# EAGLE design Deconspectrum (EAGLE 5.06)
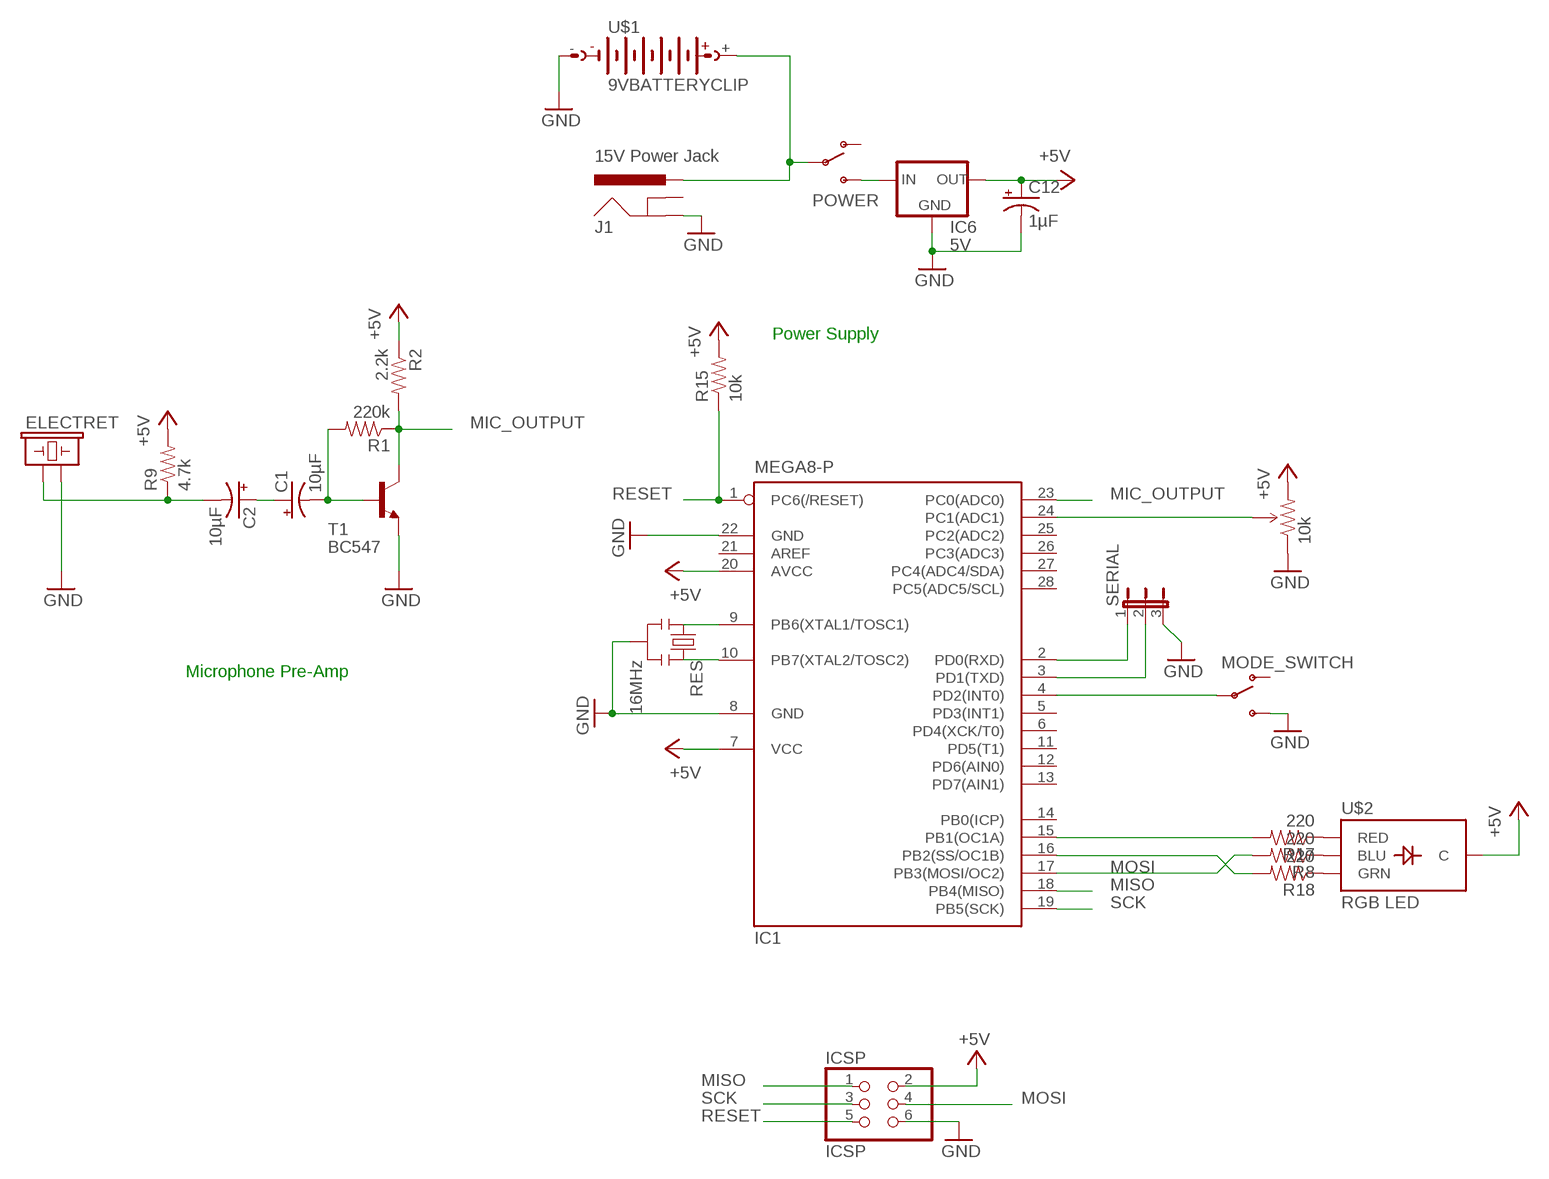
[diagram p0: schematic, sheet 1]

## Parts
C1  10µF  CAP_POLPTH1  [CPOL-RADIAL-100UF-25V]
C2  10µF  CAP_POLPTH1  [CPOL-RADIAL-100UF-25V]
C12  1µF  CAP_POLPTH1  [CPOL-RADIAL-100UF-25V]
ELECTRET  MIC9.7MM  [MIC-9.7MM]
IC1  MEGA8-P  [DIL28-3]
IC6  5V  78XXS  [78XXS]
ICSP  ICSP  PINHD-2X3  [2X03]
J1  15V Power Jack  POWER_JACKPTH  [POWER_JACK_PTH]
MODE_SWITCH  SWITCH-SPSTPTH  [SWITCH-SPDT]
POWER  SWITCH-SPSTPTH  [SWITCH-SPDT]
R1  220k  RESISTORPTH1  [AXIAL-0.3]
R2  2.2k  RESISTORPTH1  [AXIAL-0.3]
R8  220  RESISTORPTH1  [AXIAL-0.3]
R9  4.7k  RESISTORPTH1  [AXIAL-0.3]
R15  10k  RESISTORPTH1  [AXIAL-0.3]
R17  220  RESISTORPTH1  [AXIAL-0.3]
R18  220  RESISTORPTH1  [AXIAL-0.3]
RES  16MHz  RESONATORPTH  [RESONATOR-PTH]
SERIAL  JUMPER-3PTH  [1X03]
T1  BC547  [TO92]
U$1  9VBATTERYCLIP  [9VBATTERYCLIP]
U$2  RGB LED  LED-TRICOLOR-THROUGHHOLE  [LED-TRICOLOR-THROUGHHOLE]
U$3  10k  TRIMPOTPTH  [TRIM_POT_PTH]

## Nets
+5V: C12.1(+) IC1.7(VCC) IC1.20(AVCC) IC6.OUT ICSP.2 R2.P$1 R9.P$2 R15.P$2 U$2.GND(C) U$3.3(CW)
GND: C12.2(-) ELECTRET.2 IC1.8(GND) IC1.22(GND) IC6.GND ICSP.6 J1.GND MODE_SWITCH.3(S) RES.2 SERIAL.3 T1.1(E) U$1.- U$3.1(CCW)
JP1_RX: IC1.3(PD1(TXD)) SERIAL.2
JP1_TX: IC1.2(PD0(RXD)) SERIAL.1
LED_GRN: IC1.16(PB2(SS/OC1B)) R18.P$2
LED_RED: IC1.15(PB1(OC1A)) R17.P$2
MIC_OUTPUT: IC1.23(PC0(ADC0)) R1.P$1 R2.P$2 T1.3(C)
MISO: IC1.18(PB4(MISO)) ICSP.1
MOSI: IC1.17(PB3(MOSI/OC2)) ICSP.4 R8.P$2
N$1: C1.1(+) C2.1(+)
N$2: C1.2(-) R1.P$2 T1.2(B)
N$3: IC1.4(PD2(INT0)) MODE_SWITCH.2(P)
N$4: IC1.24(PC1(ADC1)) U$3.2(WIPER)
N$5: J1.PWR POWER.2(P) U$1.+
N$6: IC6.IN POWER.3(S)
N$7: C2.2(-) ELECTRET.1 R9.P$1
N$12: IC1.9(PB6(XTAL1/TOSC1)) RES.1
N$13: IC1.10(PB7(XTAL2/TOSC2)) RES.3
N$18: R18.P$1 U$2.GRN
N$19: R17.P$1 U$2.RED
N$20: R8.P$1 U$2.BLU
RESET: IC1.1(PC6(/RESET)) ICSP.5 R15.P$1
SCK: IC1.19(PB5(SCK)) ICSP.3
Unconnected: IC1.5(PD3(INT1)) IC1.6(PD4(XCK/T0)) IC1.11(PD5(T1)) IC1.12(PD6(AIN0)) IC1.13(PD7(AIN1)) IC1.14(PB0(ICP)) IC1.21(AREF) IC1.25(PC2(ADC2)) IC1.26(PC3(ADC3)) IC1.27(PC4(ADC4/SDA)) IC1.28(PC5(ADC5/SCL)) J1.GNDBREAK MODE_SWITCH.1(O) POWER.1(O)

## Notes on the sheet
- Power Supply
- Microphone Pre-Amp

## Library data of the parts
C1 C2 C12 = SparkFun:CAP_POL: Capacitor Polarized These are standard SMD and PTH capacitors. Normally 10uF, 47uF, and 100uF in electrolytic and tantalum varieties. Always verify the external diameter of the through hole cap, it varies with capacity, voltage, and manufacturer. The EIA devices should be standard.
ELECTRET = SparkFun:MIC: Microphone Omni-directional electret microphone. 9.7mm standard diameter.
IC1 = atmel:MEGA8-P: MICROCONTROLLER 8 Kbytes FLASH, 1 kbytes SRAM, 512 bytes EEPROM, USART, 4-channel 10 bit ADC, 2-channel 8 bit ADC Pin compatible with Atmega48, ATMega88, ATMega168 Source: avr.lbr
IC6 = v-reg:78XXS: VOLTAGE REGULATOR
ICSP = pinhead:PINHD-2X3: PIN HEADER
J1 = SparkFun:POWER_JACK: Power Jack This is the standard 5.5mm barrel jack for power. The PTH is the most common, proven, reliable, footprint. All others are experimental. The Slot footprint only works if the mill layer is transmitted to the PCB fab house so be warned. Spark Fun Electronics SKU : PRT-00119. Mating wall wart : TOL-00298 (and others)
MODE_SWITCH POWER = SparkFun:SWITCH-SPST: SPST Switch Simple slide switch. Spark Fun Electronics SKU : COM-00102
R1 R2 R8 R9 R15 R17 R18 = SparkFun:RESISTOR: Resistor Basic schematic elements and footprints for 0603, 1206, and PTH 1/10th watt (small) resistors.
RES = SparkFun:RESONATOR: Resonator Small SMD resonator. This is the itty bitty 10/20MHz resonators with built in caps. CSTCE10M0G55 and CSTCE20M0V53. Footprint has been reviewed closely but hasn't been tested yet.
SERIAL = SparkFun:JUMPER-3
T1 = transistor:BC547: NPN TRANSISTOR
U$1 = tedbot:9VBATTERYCLIP: 9V Battery Holder Eagle Plastic Devices 12BH611-GR
U$2 = SparkFun:LED-TRICOLOR-THROUGHHOLE
U$3 = SparkFun:TRIMPOT

## Net classes
0 default: width 0.254 mm, drill 0.305 mm, clearance 0.152 mm
2 gnd: width 0.305 mm, drill 0.508 mm, clearance 0.152 mm
3 usbvcc: width 0.508 mm, drill 0.508 mm, clearance 0.152 mm

## Board
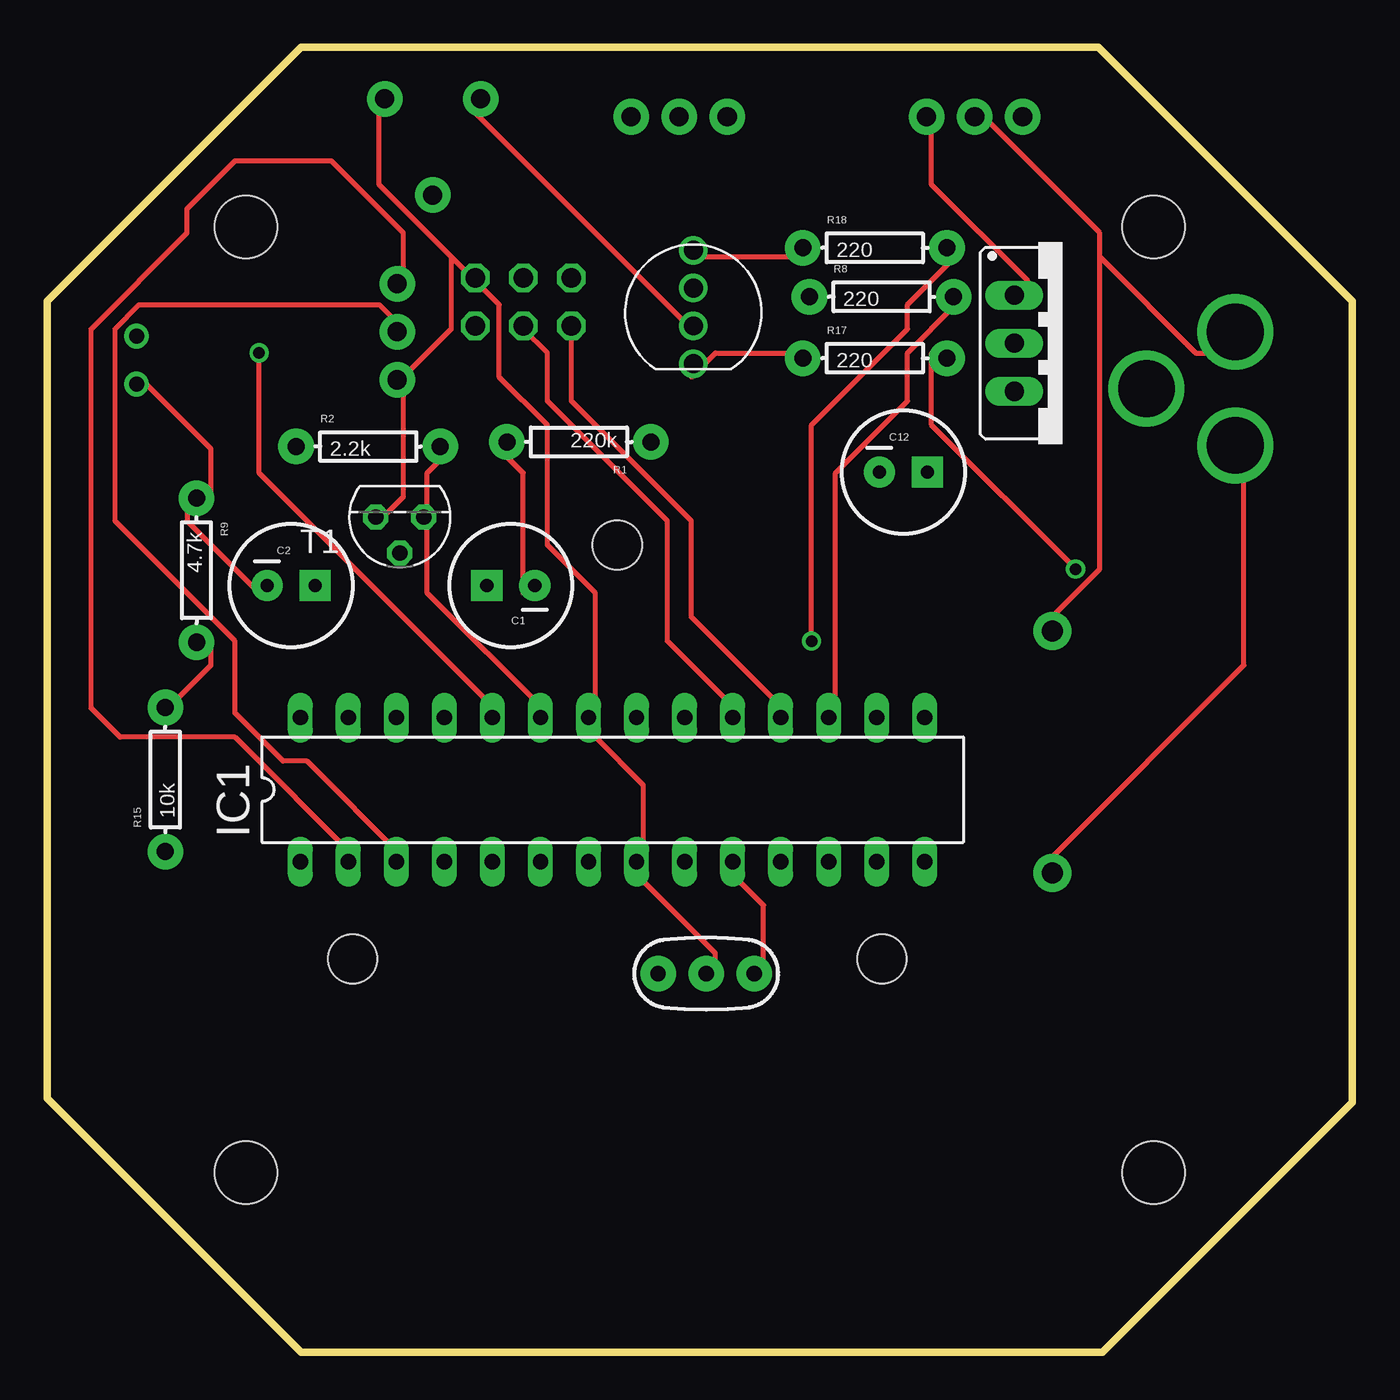
[diagram p1: board, top side]
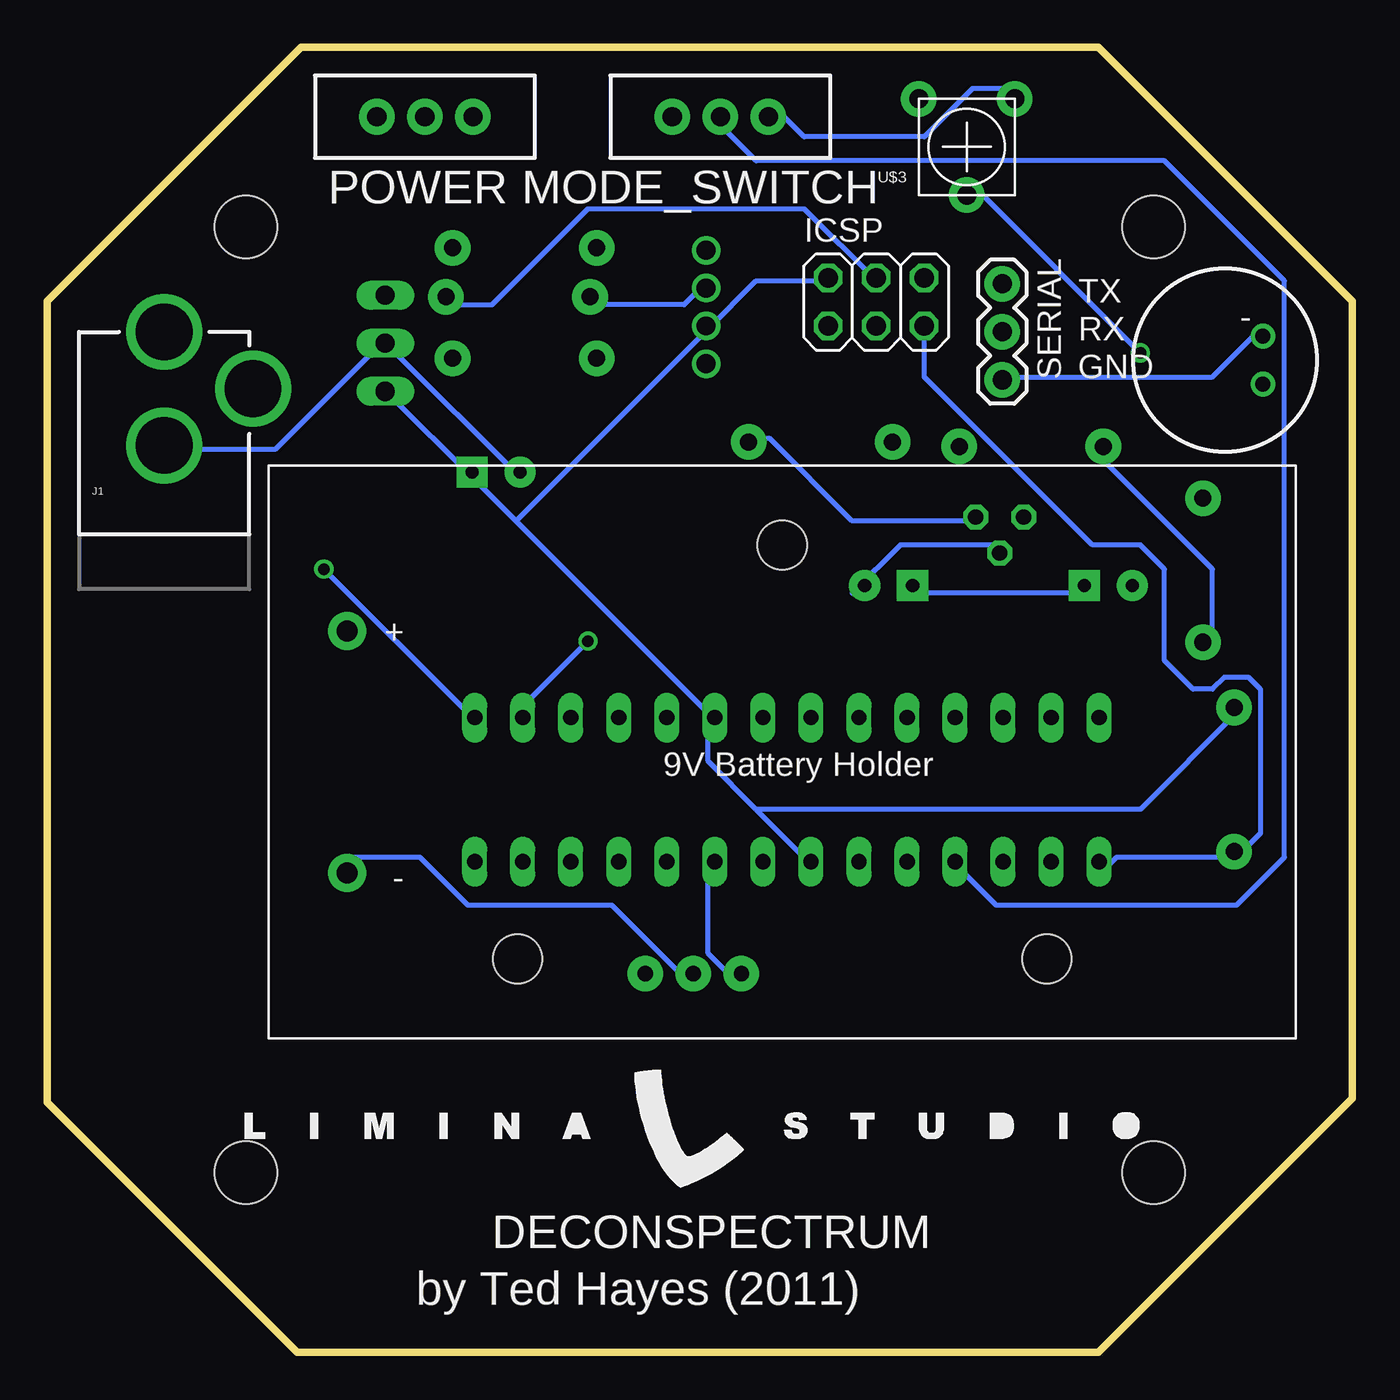
[diagram p2: board, bottom side, seen from below]

Size 69 x 69 mm. Coordinates in mm from the lower left corner, seen from the top.
Outline: 55.79,0 69,13.21 69,55.56 55.56,69 13.44,69 0,55.56 0,13.44 13.44,0 55.79,0
Copper layers (1*16): Top 0.035mm / dielectric 1.5mm / Bottom 0.035mm
Design rules "default": minimum track width 10mil, minimum drill 24mil, track to track 8mil, track to pad 8mil, pad to pad 8mil, via to via 8mil, smd to smd 8mil, copper to edge 40mil, drill to drill 8mil, minimum pad ring 10mil, minimum via ring 8mil, stop-mask expansion 4mil, vias tented up to drill 0mil, thermal gap 10mil

### Footprints (pad centres in the part's own frame; a part is rotated, then mirrored left to right if it is on the bottom)
CPOL-RADIAL-100UF-25V = drill 0.7 pad 1.651 square: 1 1.27,0 | drill 0.7 pad 1.651 round: 2 -1.27,0
MIC-9.7MM = drill 0.8 round: 1 -2,1.27; 2 -2,-1.27
DIL28-3 = drill 0.813 long: 1 -16.51,-3.81; 2 -13.97,-3.81; 3 -11.43,-3.81; 4 -8.89,-3.81; 5 -6.35,-3.81; 6 -3.81,-3.81; 7 -1.27,-3.81; 8 1.27,-3.81; 9 3.81,-3.81; 10 6.35,-3.81; 11 8.89,-3.81; 12 11.43,-3.81; 13 13.97,-3.81; 14 16.51,-3.81; 15 16.51,3.81; 16 13.97,3.81; 17 11.43,3.81; 18 8.89,3.81; 19 6.35,3.81; 20 3.81,3.81; 21 1.27,3.81; 22 -1.27,3.81; 23 -3.81,3.81; 24 -6.35,3.81; 25 -8.89,3.81; 26 -11.43,3.81; 27 -13.97,3.81; 28 -16.51,3.81
78XXS = drill 1.016 long: GND 0,-2.54; IN -2.54,-2.54; OUT 2.54,-2.54
2X03 = drill 1.016 octagon: 1 -2.54,-1.27; 2 -2.54,1.27; 3 0,-1.27; 4 0,1.27; 5 2.54,-1.27; 6 2.54,1.27
POWER_JACK_PTH = drill 2.997 round: GND 0,7.7; GNDBREAK 4.7,10.7; PWR 0,13.7
SWITCH-SPDT = drill 1.016 pad 1.88 round: 1 0,2.54; 2 0,0; 3 0,-2.54
AXIAL-0.3 = drill 0.9 pad 1.88 round: P$1 -3.81,0; P$2 3.81,0
RESONATOR-PTH = drill 0.8 pad 1.88 round: 1 -2.54,0; 2 0,0; 3 2.54,0
1X03 = drill 1.016 pad 1.88 round: 1 0,0; 2 2.54,0; 3 5.08,0
TO92 = drill 0.813 octagon: 1 1.27,0; 2 0,1.905; 3 -1.27,0
9VBATTERYCLIP = drill 1.1 pad 2 round: + 23,-6.4; - 23,6.4 | hole 2.6: 0,-10.95; -14,10.95; 14,10.95
LED-TRICOLOR-THROUGHHOLE = drill 1 round: BLU 1,0; GND -1,0; GRN 3,0; RED -3,0
TRIM_POT_PTH = drill 1 pad 1.88 round: 1 -2.54,-2.54; 2 0,2.54; 3 2.54,-2.54
STAND-OFF = hole 3.302: 0,0

### Placement (x,y rotation side)
C1  24.51,40.54 180 top
C2  12.89,40.54 0 top
C12  45.27,46.54 0 top
ELECTRET  6.72,52.46 180 bottom
IC1  29.89,29.75 0 top
IC6  53.67,53.35 270 top
ICSP  25.17,55.54 0 bottom
J1  62.82,40.25 0 bottom
MODE_SWITCH  33.41,65.33 90 bottom
POWER  49.03,65.33 90 bottom
R1  28.11,48.13 180 top
R2  16.97,47.89 0 top
R8  44.11,55.81 0 top
R9  7.89,41.35 270 top
R15  6.24,30.28 90 top
R17  43.76,52.56 0 top
R18  43.76,58.4 0 top
RES  34.84,20.02 0 top
SERIAL  18.5,56.5 270 bottom
T1  18.64,44.16 180 top
U$1  30.14,31.74 180 bottom
U$2  34.16,55.27 90 top
U$3  20.38,63.73 180 bottom
U$4  [STAND-OFF]  58.5,9.5 0 top
U$5  [STAND-OFF]  58.5,59.5 0 top
U$6  [STAND-OFF]  10.5,59.5 0 top
U$7  [STAND-OFF]  10.5,9.5 0 top

### Tracks (layer width: path | path; a pad name or v marks a point on that pad's centre or on a via)
+5V
  Top 0.254: U$3.3 22.63,65.54 34.06,54.11 U$2.GND | R15.P$2 6.12,33.79 8.66,36.33 8.66,37.6 R9.P$2
  Bottom 0.254: 34.06,54.11 31.52,56.65 27.71,56.65 ICSP.2 | R2.P$1 13.74,47.76 7.39,41.41 7.39,37.6 R9.P$2 | 46.76,46.49 50.57,50.3 IC6.OUT | 31.52,28.71 34.06,31.25 34.06,32.52 IC1.20 34.06,33.79 44.22,43.95 | 31.52,28.71 28.98,26.17 IC1.7 | 44.22,43.95 46.76,46.49 | 46.76,46.49 C12.1 | 31.52,28.71 11.2,28.71 6.12,33.79 R15.P$2 | 44.22,43.95 34.06,54.11 | 34.06,54.11 U$2.GND
GND
  Top 0.254: 18.82,51.57 18.82,45.22 17.55,43.95 T1.1 | 21.36,57.92 17.55,61.73 17.55,65.54 U$3.1 | 22.63,56.65 21.36,57.92 | 18.82,51.57 21.36,54.11 21.36,57.92 | 18.82,51.57 SERIAL.3 | RES.2 35.33,19.82 35.33,21.09 31.52,24.9 IC1.8 31.52,26.17 31.52,29.98 28.98,32.52 IC1.22 28.98,33.79 28.98,40.14 26.44,42.68 26.44,49.03 23.9,51.57 23.9,55.38 22.63,56.65 | U$1.- 53.11,26.17 63.27,36.33 63.27,47.76 J1.GND | 22.63,56.65 ICSP.6
  Bottom 0.254: ELECTRET.2 4.85,54.11 7.39,51.57 18.82,51.57 SERIAL.3 | MODE_SWITCH.3 30.25,65.54 28.98,64.27 22.63,64.27 20.09,66.81 17.55,66.81 U$3.1 | C12.2 44.22,46.49 50.57,52.84 IC6.GND 51.84,52.84 56.92,47.76 62,47.76 J1.GND | RES.2 35.33,19.82 39.14,23.63 46.76,23.63 49.3,26.17 53.11,26.17 U$1.-
JP1_RX
  Top 0.254: IC1.3 18.82,26.17 13.74,31.25 12.47,31.25 9.93,33.79 9.93,37.6 3.58,43.95 3.58,54.11 4.85,55.38 17.55,55.38 18.82,54.11 SERIAL.2
JP1_TX
  Top 0.254: IC1.2 16.28,26.17 9.93,32.52 3.85,32.52 2.31,34.06 2.31,54.11 7.39,59.19 7.39,60.46 9.93,63 15.01,63 16.28,61.73 18.82,59.19 18.82,56.65 SERIAL.1
LED_GRN  (via drill 0.61)
  Top 0.254: v40.41,37.6 40.41,49.03 45.49,54.11 45.49,55.38 48.03,57.92 R18.P$2
  Bottom 0.254: v40.41,37.6 44.22,33.79 IC1.16
LED_RED  (via drill 0.61)
  Top 0.254: v54.38,41.41 46.76,49.03 46.76,52.84 R17.P$2
  Bottom 0.254: v54.38,41.41 46.76,33.79 IC1.15
MIC_OUTPUT
  Top 0.254: 20.09,43.95 20.09,40.14 26.44,33.79 IC1.23 | 20.09,43.95 20.09,46.49 21.36,47.76 R2.P$2 | 20.09,43.95 T1.3
  Bottom 0.254: R1.P$1 30.82,48.33 26.44,43.95 20.09,43.95 T1.3
MISO
  Top 0.254: IC1.18 39.14,33.79 34.06,38.87 34.06,43.95 27.71,50.3 ICSP.1
MOSI
  Top 0.254: IC1.17 41.68,33.79 41.68,46.49 45.49,50.3 45.49,52.84 48.03,55.38 R8.P$2
  Bottom 0.254: ICSP.4 25.17,56.65 28.98,60.46 40.41,60.46 45.49,55.38 48.03,55.38 R8.P$2
N$1
  Bottom 0.254: C2.1 13.74,40.14 22.63,40.14 C1.1
N$2
  Top 0.254: R1.P$2 23.9,47.76 25.17,46.49 25.17,40.14 C1.2
  Bottom 0.254: T1.2 18.82,42.68 23.9,42.68 26.44,40.14 C1.2
N$3
  Bottom 0.254: IC1.4 21.36,26.17 18.82,23.63 6.12,23.63 3.58,26.17 3.58,56.65 9.93,63 31.52,63 34.06,65.54 MODE_SWITCH.2
N$4  (via drill 0.61)
  Top 0.254: v11.2,52.84 11.2,46.49 23.9,33.79 IC1.24
  Bottom 0.254: v11.2,52.84 20.09,61.73 U$3.2
N$5
  Top 0.254: 55.65,57.92 55.65,59.19 49.3,65.54 POWER.2 | 55.65,57.92 60.73,52.84 62,52.84 J1.PWR | 55.65,57.92 55.65,41.41 53.11,38.87 U$1.+
N$6
  Top 0.254: IC6.IN 51.84,56.65 46.76,61.73 46.76,65.54 POWER.3
N$7
  Top 0.254: ELECTRET.1 4.85,51.57 8.66,47.76 8.66,45.22 R9.P$1 7.39,45.22 7.39,43.95 11.2,40.14 C2.2
N$12
  Bottom 0.254: IC1.9 34.06,24.9 34.06,21.09 32.79,19.82 RES.1
N$13
  Top 0.254: IC1.10 36.6,24.9 37.87,23.63 37.87,19.82 RES.3
N$18
  Top 0.254: U$2.GRN 34.06,57.92 39.14,57.92 R18.P$1
N$19
  Top 0.254: U$2.RED 34.06,51.57 35.33,52.84 39.14,52.84 R17.P$1
N$20
  Bottom 0.254: U$2.BLU 34.06,56.65 35.33,55.38 40.41,55.38 R8.P$1
RESET
  Bottom 0.254: 6.12,26.17 12.47,26.17 13.74,24.9 IC1.1 | 6.12,26.17 4.85,27.44 4.85,35.06 5.47,35.69 6.77,35.69 7.39,35.06 8.43,35.06 9.93,36.56 9.93,41.41 11.2,42.68 13.74,42.68 21.36,50.3 22.63,51.57 ICSP.5 | 6.12,26.17 R15.P$1
SCK
  Top 0.254: IC1.19 36.6,33.79 32.79,37.6 32.79,43.95 26.44,50.3 26.44,52.84 25.17,54.11 ICSP.3

### Text on the board
bPlace: TX | RX | GND | DECONSPECTRUM | by Ted Hayes (2011)